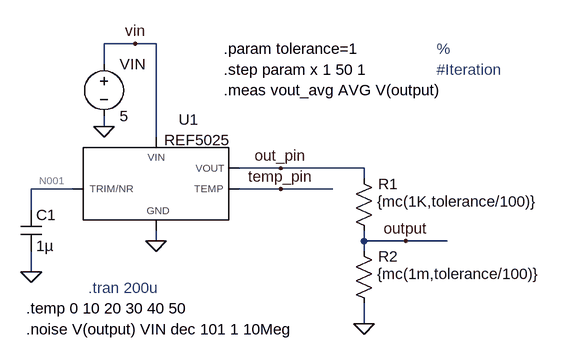
[diagram p0: schematic 03-REF5025_noise_voltage_divider.asc]
03-REF5025_noise_voltage_divider.asc, the LTspice schematic file:
Version 4
SHEET 1 880 680
WIRE 112 -48 64 -48
WIRE 144 -48 112 -48
WIRE 64 -16 64 -48
WIRE 64 80 64 64
WIRE 144 96 144 -48
WIRE 336 144 272 144
WIRE 464 144 336 144
WIRE 464 160 464 144
WIRE 16 176 -48 176
WIRE 336 176 272 176
WIRE 416 176 336 176
WIRE -48 208 -48 176
WIRE 144 256 144 240
WIRE 464 256 464 240
WIRE 528 256 464 256
WIRE 592 256 528 256
WIRE 464 272 464 256
WIRE -48 304 -48 272
WIRE 464 384 464 352
FLAG 144 256 0
FLAG 64 80 0
FLAG 336 144 out_pin
FLAG 336 176 temp_pin
FLAG 112 -48 vin
FLAG 464 384 0
FLAG 528 256 output
FLAG -48 304 0
SYMBOL REF5025 160 176 R0
SYMATTR InstName U1
SYMBOL voltage 64 -32 R0
SYMATTR InstName VIN
SYMATTR Value 5
SYMBOL res 448 144 R0
WINDOW 0 38 24 Left 2
WINDOW 3 36 51 Left 2
SYMATTR InstName R1
SYMATTR Value {mc(1K,tolerance/100)}
SYMBOL res 448 256 R0
WINDOW 0 38 24 Left 2
WINDOW 3 36 51 Left 2
SYMATTR InstName R2
SYMATTR Value {mc(1m,tolerance/100)}
SYMBOL cap -64 208 R0
SYMATTR InstName C1
SYMATTR Value 1µ
SYMATTR SpiceLine V=25 Irms=0 Rser=0.014 Lser=1000p mfg="Wьrth Elektronik" pn="885012210012 WCAP-CSGP 1812" type="X7R"
TEXT 40 328 Left 2 ;.tran 200u
TEXT -56 360 Left 2 !.temp 0 10 20 30 40 50
TEXT 248 -40 Left 2 !.param tolerance=1
TEXT 576 -40 Left 2 ;%
TEXT 248 -8 Left 2 !.step param x 1 50 1
TEXT 248 24 Left 2 !.meas vout_avg AVG V(output)
TEXT 576 -8 Left 2 ;#Iteration
TEXT -56 392 Left 2 !.noise V(output) VIN dec 101 1 10Meg

The netlist it stands for:
* 03-REF5025_noise_voltage_divider.asc
XU1 vin temp_pin 0 N001 out_pin REF5025  ; pins 2 3 4 5 6
VIN vin 0 5
R1 out_pin output {mc(1K,tolerance/100)}
R2 output 0 {mc(1m,tolerance/100)}
C1 N001 0 1µ V=25 Irms=0 Rser=0.014 Lser=1000p mfg="Wьrth Elektronik" pn="885012210012 WCAP-CSGP 1812" type="X7R"
* .tran 200u
.temp 0 10 20 30 40 50
.param tolerance=1
* %
.step param x 1 50 1
.meas vout_avg AVG V(output)
* #Iteration
.noise V(output) VIN dec 101 1 10Meg
.lib REF5025.LIB
.backanno
.end

* Results of the author's LTspice run, read from the files saved beside the schematic
* Operating Point (first step), zero values left out:
*   V(out_pin) = 2.501 V
*   V(vin) = 5 V
*   V(temp_pin) = 504.3 mV
*   V(n001) = 1.2 V
*   V(output) = 2.53 µV
*   I(R1) = 2.526 mA
*   I(R2) = 2.526 mA
*   I(Vin) = -3.279 mA
*   Ix(u1:2) = 3.279 mA
*   Ix(u1:4) = -667.5 µA
*   Ix(u1:6) = -2.526 mA
* From the log:
*   Measurement "vout_avg" FAIL'ed